# Altium schematic sheet električna šema.SchDoc
size A
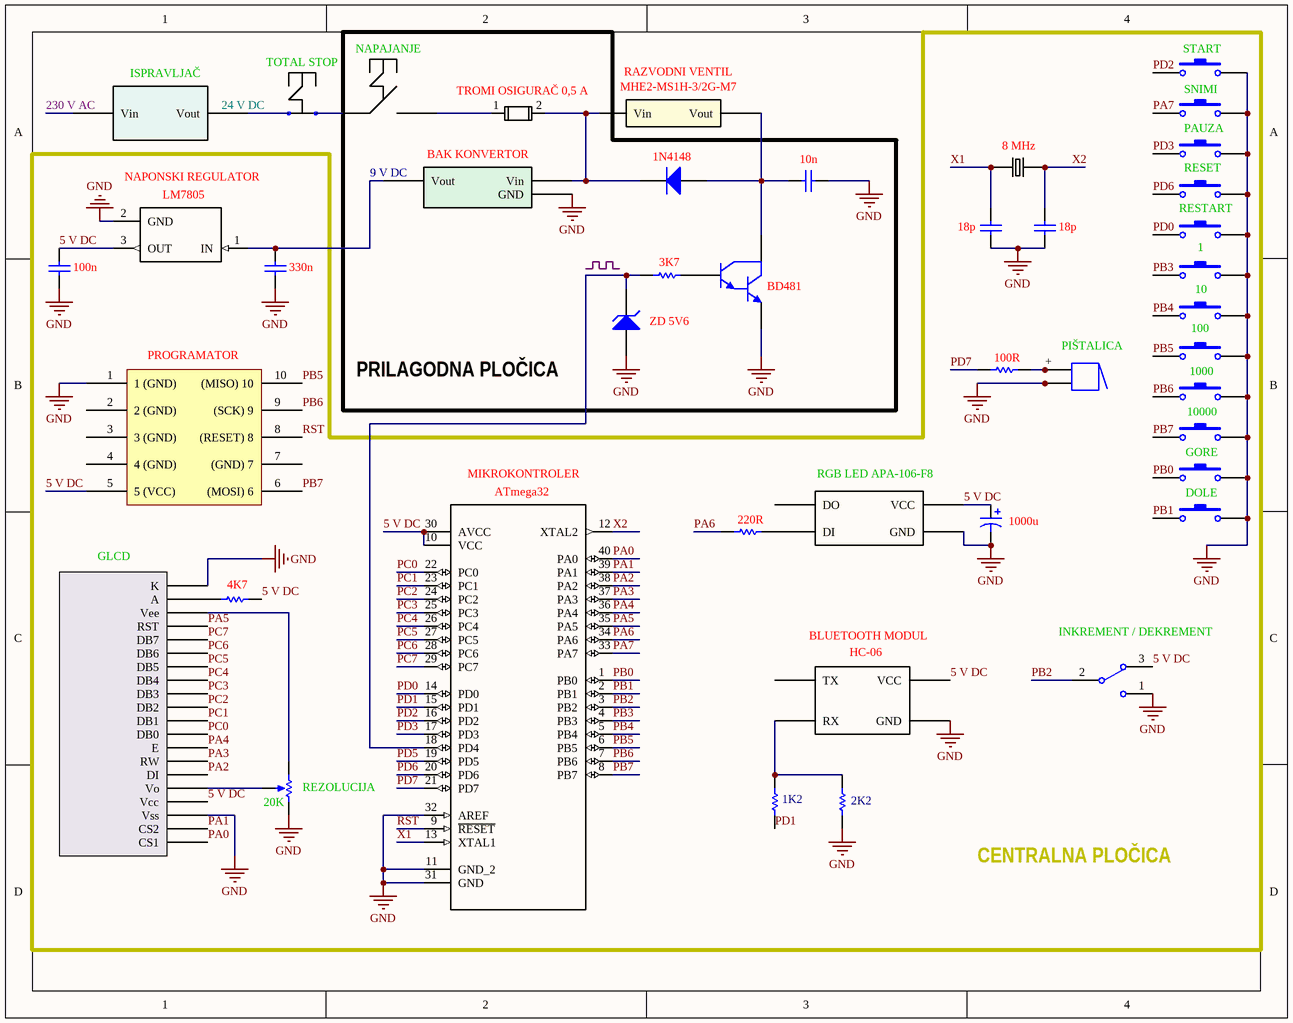
[diagram p0: električna šema.SchDoc]

## Parts
(Parts that share a designator on the sheet are numbered #1, #2 ... from top to bottom, then left to right.)
1  SW-PB  [SPST-2]  (value not drawn)
1K2  Res Semi  [AXIAL-0.5]  (value not drawn)
2K2  Res Semi  [AXIAL-0.5]  (value not drawn)
3K7  WM  [AXIAL-0.5]  (value not drawn)
4K7  Res Semi  [AXIAL-0.5]  (value not drawn)
8_MHz  8Mhz  [*XTAL_ECS-80-S-4X]  (value not drawn)
10  SW-PB  [SPST-2]  (value not drawn)
10n  Cap  [RAD-0.3]  (value not drawn)
18p#1  22pF  [RAD-0.3]  (value not drawn)
18p#2  22pF  [RAD-0.3]  (value not drawn)
20K  REZOLUCIJA  [VR5]
24_V_DC  TOTAL STOP
100  SW-PB  [SPST-2]  (value not drawn)
100R  Res Semi  [AXIAL-0.5]  (value not drawn)
220R  Res Semi  [AXIAL-0.5]  (value not drawn)
1000  SW-PB  [SPST-2]  (value not drawn)
1000u  Cap Pol1  [RB7.6-15]  (value not drawn)
10000  SW-PB  [SPST-2]  (value not drawn)
*#1  NAPAJANJE
*#2  RGB LED APA-106-F8
?#1  1N4148  [SMC]
?#2  BAK KONVERTOR
BD481  NPN1  [TO-92]  (value not drawn)
C?#1  100n  [RAD-0.3]
C?#2  330n  [RAD-0.3]
DOLE  SW-PB  [SPST-2]  (value not drawn)
GLCD  lcd  (value not drawn)
GORE  SW-PB  [SPST-2]  (value not drawn)
HC-06  BLUETOOTH MODUL
INKREMENT_/_DEKREMENT  SW-SPDT  [TL36WW15050]  (value not drawn)
ISPRAVLJAČ  Component_1  (value not drawn)
MHE2-MS1H-3/2G-M7  RAZVODNI VENTIL
MIKROKONTROLER  ATmega32  [*DIP254P1524X482-40]
NAPONSKI_REGULATOR  LM7805  [*TO254P1054X470X2600-3]
PAUZA  SW-PB  [SPST-2]  (value not drawn)
PIŠTALICA  +  [ABSM-1574]
PROGRAMATOR  progrmator  [302-S101]  (value not drawn)
RESET  SW-PB  [SPST-2]  (value not drawn)
RESTART  SW-PB  [SPST-2]  (value not drawn)
SNIMI  SW-PB  [SPST-2]  (value not drawn)
START  SW-PB  [SPST-2]  (value not drawn)
TROMI_OSIGURAČ_0,5_A  Kuciste za tromi osigurac  [*696101000002]  (value not drawn)
ZD_5V6  D Zener  [DIODE-0.7]  (value not drawn)

## Blocks framed on the sheet
CENTRALNA PLOČICA: 1 1K2 2K2 4K7 8_MHz 10 18p#1 18p#2 20K 100 100R 220R 1000 1000u 10000 *#2 C?#1 C?#2 DOLE GLCD GORE HC-06 INKREMENT_/_DEKREMENT MIKROKONTROLER NAPONSKI_REGULATOR PAUZA PIŠTALICA PROGRAMATOR RESET RESTART SNIMI START
PRILAGODNA PLOČICA: 3K7 10n *#1 ?#1 ?#2 BD481 TROMI_OSIGURAČ_0,5_A ZD_5V6

## Nets
GND: 1.2 2K2.1 10.2 10n.2 18p#1.2 18p#2.1 20K.2(BOT) 100.2 1000.2 1000u.2 10000.2 *#2.?3(GND) ?#2.?3(GND) BD481.3(E) C?#1.1 C?#2.1 DOLE.2 GLCD.?1(K) GLCD.?18(Vss) GORE.2 HC-06.?2(GND) INKREMENT_/_DEKREMENT.1 MIKROKONTROLER.11(GND_2) MIKROKONTROLER.31(GND) MIKROKONTROLER.32(AREF) NAPONSKI_REGULATOR.2(GND) PAUZA.2 PIŠTALICA.2 PIŠTALICA.2A PROGRAMATOR.1(1_(GND)) RESET.2 RESTART.2 SNIMI.2 START.2 ZD_5V6.1(A)
5 V DC: 4K7.2 1000u.1 *#2.?1(VCC) C?#1.2 GLCD.?17(Vcc) HC-06.?1(VCC) INKREMENT_/_DEKREMENT.3 MIKROKONTROLER.10(VCC) MIKROKONTROLER.30(AVCC) NAPONSKI_REGULATOR.3(OUT) PROGRAMATOR.5(5_(VCC))
9 V DC: ?#2.?2(Vout) C?#2.2 NAPONSKI_REGULATOR.1(IN)
230 V AC: ISPRAVLJAČ.?1(Vin)
PA0: GLCD.?20(CS1) MIKROKONTROLER.40(PA0)
PA1: GLCD.?19(CS2) MIKROKONTROLER.39(PA1)
PA2: GLCD.?15(DI) MIKROKONTROLER.38(PA2)
PA3: GLCD.?14(RW) MIKROKONTROLER.37(PA3)
PA4: GLCD.?13(E) MIKROKONTROLER.36(PA4)
PA5: GLCD.?4(RST) MIKROKONTROLER.35(PA5)
PA6: 220R.1 MIKROKONTROLER.34(PA6)
PA7: MIKROKONTROLER.33(PA7) SNIMI.1
PB0: GORE.1 MIKROKONTROLER.1(PB0)
PB1: DOLE.1 MIKROKONTROLER.2(PB1)
PB2: INKREMENT_/_DEKREMENT.2 MIKROKONTROLER.3(PB2)
PB3: 1.1 MIKROKONTROLER.4(PB3)
PB4: 10.1 MIKROKONTROLER.5(PB4)
PB5: 100.1 MIKROKONTROLER.6(PB5) PROGRAMATOR.10((MISO)_10)
PB6: 1000.1 MIKROKONTROLER.7(PB6) PROGRAMATOR.9((SCK)_9)
PB7: 10000.1 MIKROKONTROLER.8(PB7) PROGRAMATOR.6((MOSI)_6)
PC0: GLCD.?12(DB0) MIKROKONTROLER.22(PC0)
PC1: GLCD.?11(DB1) MIKROKONTROLER.23(PC1)
PC2: GLCD.?10(DB2) MIKROKONTROLER.24(PC2)
PC3: GLCD.?9(DB3) MIKROKONTROLER.25(PC3)
PC4: GLCD.?8(DB4) MIKROKONTROLER.26(PC4)
PC5: GLCD.?7(DB5) MIKROKONTROLER.27(PC5)
PC6: GLCD.?6(DB6) MIKROKONTROLER.28(PC6)
PC7: GLCD.?5(DB7) MIKROKONTROLER.29(PC7)
PD0: MIKROKONTROLER.14(PD0) RESTART.1
PD1: 1K2.1 MIKROKONTROLER.15(PD1)
PD2: MIKROKONTROLER.16(PD2) START.1
PD3: MIKROKONTROLER.17(PD3) PAUZA.1
PD5: MIKROKONTROLER.19(PD5)
PD6: MIKROKONTROLER.20(PD6) RESET.1
PD7: 100R.1 MIKROKONTROLER.21(PD7)
RST: MIKROKONTROLER.9(~{RESET}) PROGRAMATOR.8((RESET)_8)
X1: 8_MHz.1 18p#2.2 MIKROKONTROLER.13(XTAL1)
X2: 8_MHz.2 18p#1.1 MIKROKONTROLER.12(XTAL2)
Net1K2_2: 1K2.2 2K2.2 HC-06.?3(RX)
Net3K7_1: 3K7.1 MIKROKONTROLER.18(PD4) ZD_5V6.2(K)
Net3K7_2: 3K7.2 BD481.2(B)
Net4K7_1: 4K7.1 GLCD.?2(A)
Net10n_1: 10n.1 ?#1.1(A) BD481.1(C) MHE2-MS1H-3/2G-M7.?2(Vout)
Net20K_1: 20K.1(TOP) GLCD.?3(Vee)
Net20K_3: 20K.3(TAP) GLCD.?16(Vo)
Net100R_2: 100R.2 PIŠTALICA.1 PIŠTALICA.1A
Net220R_2: 220R.2 *#2.?2(DI)
Net*#1_?1: *#1.?1 TROMI_OSIGURAČ_0,5_A.1
Net?#1_2: ?#1.2(K) ?#2.?1(Vin) MHE2-MS1H-3/2G-M7.?1(Vin) TROMI_OSIGURAČ_0,5_A.2

Not connected (* = marked no-connect by the designer): *#2 ?4(DO); HC-06 ?4(TX); ISPRAVLJAČ ?2(Vout); PROGRAMATOR 2(2_(GND)) 3(3_(GND)) 4(4_(GND)) 7((GND)_7)

## Library data of the parts
1 10 100 1000 10000 DOLE GORE PAUZA RESET RESTART SNIMI START = SW-PB: Switch; Published: 24-Mar-1999; LatestRevisionDate: 17-Jul-2002; LatestRevisionNote: Re-released for DXP Platform.; PackageReference: SPST-2; Publisher: Altium Limited; PackageDescription: Switch; 2 Leads
1K2 2K2 3K7 4K7 100R 220R = Res Semi: Semiconductor Resistor; Published: 8-Jun-2000; LatestRevisionDate: 17-Jul-2002; LatestRevisionNote: Re-released for DXP Platform.; PackageReference: AXIAL-0.5; Publisher: Altium Limited; PackageDescription: Axial Device, Thru-Hole; 2 Leads; 0.5 in Pin Spacing
8_MHz = ECS-80-S-4X: Crystal 8MHz Series 2-Pin HC-49/U; MF: ECS Inc.; Availability: Unavailable; SnapEDA_Link: https://www.snapeda.com/parts/ECS-80-S-4X/ECS%20Inc./view-part/?ref=snap; Price: None; Package: HC-49/US ECS International; MP: ECS-80-S-4X; Value: *
10n 18p#1 18p#2 C?#1 C?#2 = Cap: Capacitor; Published: 8-Jun-2000; LatestRevisionDate: 17-Jul-2002; LatestRevisionNote: Re-released for DXP Platform.; PackageReference: RAD-0.3; Publisher: Altium Limited; PackageDescription: Radial Cap, Thru-Hole; 2 Leads; 0.3 in Pin Spacing
20K = RPot: Potentiometer; Sim Note: Enter the Resistance value and the set point into parameter fields.; Set Position: 0.5; Published: 8-Jun-2000; LatestRevisionDate: 17-Jul-2002; LatestRevisionNote: Re-released for DXP Platform.; PackageReference: VR5; Publisher: Altium Limited; PackageDescription: Variable Resistor, Thru-Hole; 3 Leads
24_V_DC = Component_1
1000u = Cap Pol1: Polarized Capacitor (Radial); Published: 8-Jun-2000; LatestRevisionDate: 17-Jul-2002; LatestRevisionNote: Re-released for DXP Platform.; PackageReference: RB7.6-15; Publisher: Altium Limited; PackageDescription: Polarized Capacitor (Radial); 2 Leads
*#2 = rgb led
?#1 = Diode: Default Diode; Published: 8-Jun-2000; LatestRevisionDate: 17-Jul-2002; LatestRevisionNote: Re-released for DXP Platform.; PackageVersion: Sep-1996; PackageReference: SMC; Publisher: Altium Limited; PackageDescription: DO-214-AB/SMC; 2 C-Bend Leads; Body 7.9 x 5.9 mm, inc. leads (LxW); Code_JEDEC: DO-214-AB
?#2 = bak
BD481 = NPN1: NPN Darlington Bipolar Transistor; Published: 8-Jun-2000; LatestRevisionDate: 17-Jul-2002; LatestRevisionNote: Re-released for DXP Platform.; DatasheetVersion: 1989; PackageVersion: 1989; PackageReference: TO-92; Publisher: Altium Limited; PackageDescription: TO, Flat Index; 3 In-Line, Axial Leads; Body Dia. 4.6mm; Leads 0.41 x 0.39 mm (max); Code_JEDEC: TO-92
HC-06 = bt
INKREMENT_/_DEKREMENT = SW-SPDT: SPDT Subminiature Toggle Switch, Right Angle Mounting, Vertical Actuation; Published: 24-Mar-1999; LatestRevisionDate: 17-Dec-2003; LatestRevisionNote: Schematic revised, PCB Footprint replaced.; DatasheetVersion: 05-Dec-2000; PackageReference: TL36WW15050; Publisher: Altium Limited; PackageDescription: Switch; 4 Leads; ComponentLink1Description: Manufacturer Link; ComponentLink1URL: http://www.apem.com
MHE2-MS1H-3/2G-M7 = rayvodni ventill
MIKROKONTROLER = ATMEGA32-16PU: ATmega Series 16 MHz 32 KB Flash 2 KB SRAM 8-Bit Microcontroller - DIP-40; MF: Microchip; Package: DIP-40 Microchip; Availability: Unavailable; MP: ATMEGA32-16PU; SnapEDA_Link: https://www.snapeda.com/parts/ATMEGA32-16PU/Microchip/view-part/?ref=snap; Price: None; Value: *
NAPONSKI_REGULATOR = LM7805CT/NOPB: Linear Voltage Regulator IC Positive Fixed 1 Output 1A TO-220-3; MF: ON Semiconductor; Package: TO-220 ON Semiconductor; Availability: Unavailable; SnapEDA_Link: https://www.snapeda.com/parts/LM7805CT/ON%20Semiconductor/view-part/546231/?ref=snap; MP: LM7805CT; Price: None; Value: *
PIŠTALICA = Buzzer: Magnetic Transducer Buzzer; Published: 24-Mar-1999; LatestRevisionDate: 17-Dec-2003; LatestRevisionNote: Schematic revised, PCB Footprint replaced.; DatasheetVersion: 17-Dec-2003; PackageReference: ABSM-1574; Publisher: Altium Limited; PackageDescription: Magnetic Transducer Buzzer; ComponentLink1Description: Manufacturer Link; ComponentLink1URL: http://www.megastar.com/linecard/buzzmode/index.php
PROGRAMATOR = 302-S101: 302-S101 connector
TROMI_OSIGURAČ_0,5_A = 696101000002: Fuse Holder, 250 V, 10 A, Cartridge Fuse Holder, Through Hole, 1; MF: Wurth Electronics; Availability: Unavailable; MP: 696101000002; SnapEDA_Link: https://www.snapeda.com/parts/696101000002/Wurth%20Electronics%20Inc./view-part/?ref=snap; Price: None; Package: None; Value: *
ZD_5V6 = D Zener: Zener Diode; Published: 8-Jun-2000; LatestRevisionDate: 17-Jul-2002; LatestRevisionNote: Re-released for DXP Platform.; PackageReference: DIODE-0.7; Publisher: Altium Limited; PackageDescription: Diode, Thru-Hole; 2 Leads; 0.7 in Pin Spacing